# EAGLE schematic Group12_411_REV1 (EAGLE 9.2.1)
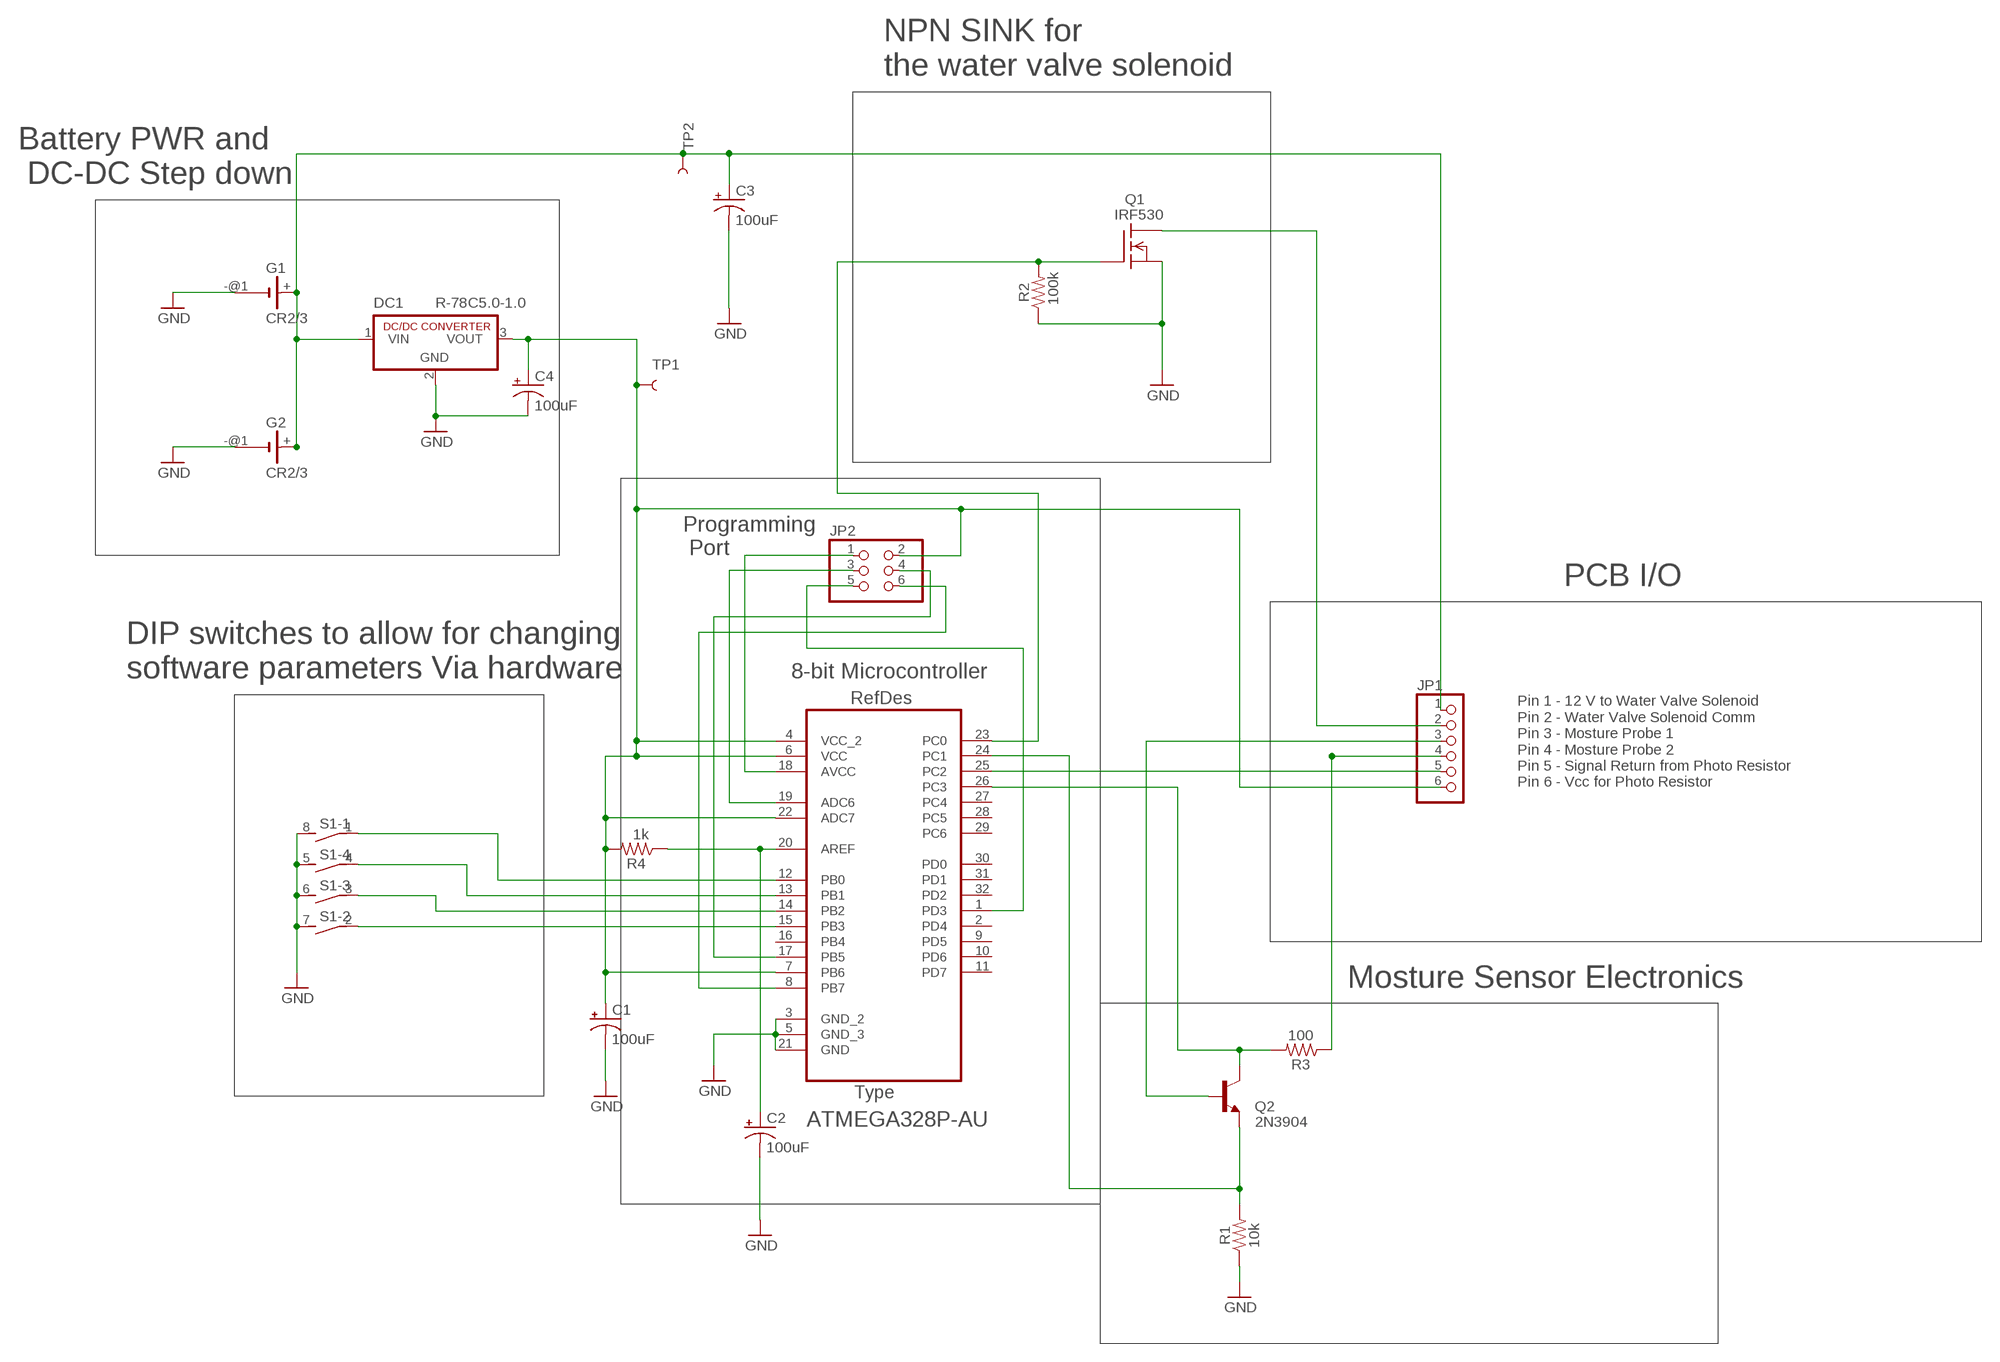
[diagram p0: schematic, sheet 1]

## Parts
ATMEGA328  ATMEGA328P-AU  [QFP80P900X900X120-32N]
C1  100uF  100UF-POLAR-EIA7343-16V-10%(TANT)  [EIA7343]
C2  100uF  100UF-POLAR-EIA7343-16V-10%(TANT)  [EIA7343]
C3  100uF  100UF-POLAR-EIA7343-16V-10%(TANT)  [EIA7343]
C4  100uF  100UF-POLAR-EIA7343-16V-10%(TANT)  [EIA7343]
DC1  R-78C5.0-1.0  [SIP3]
G1  CR2/3  [CR2/3]
G2  CR2/3  [CR2/3]
JP1  PINHD-1X6  [1X06]
JP2  PINHD-2X3  [2X03]
Q1  VN66AF  [TO202]
Q2  600mA/40V  TRANS_NPN-MMBT2222AL  [SOT23-3]
R1  R-US_M0805  [M0805]
R2  R-US_M0805  [M0805]
R3  R-US_M0805  [M0805]
R4  R-US_M0805  [M0805]
S1  DIP04S  [DIP04S]
TP1  TEST-POINT3  [PAD.03X.03]
TP2  TEST-POINT3  [PAD.03X.03]

## Nets
GND: ATMEGA328.3(GND_2) ATMEGA328.5(GND_3) ATMEGA328.21(GND) C1.C(-) C2.C(-) C3.C(-) C4.C(-) DC1.2(GND) G1.-@1(-) G2.-@1(-) Q1.1(S) R1.1 R2.1 S1.5 S1.6 S1.7 S1.8
N$1: ATMEGA328.25(PC2) JP1.5
N$2: ATMEGA328.18(AVCC) JP2.1
N$3: C3.A(+) DC1.1(VIN) G1.+ G2.+ JP1.1 TP2.P$1
N$4: ATMEGA328.17(PB5) JP2.4
N$5: ATMEGA328.19(ADC6) JP2.3
N$6: ATMEGA328.8(PB7) JP2.6
N$7: ATMEGA328.1(PD3) JP2.5
N$8: ATMEGA328.23(PC0) Q1.2(G) R2.2
N$9: JP1.3 Q2.1(B)
N$10: ATMEGA328.13(PB1) S1.4
N$11: JP1.2 Q1.3(D)
N$12: ATMEGA328.12(PB0) S1.1
N$13: ATMEGA328.14(PB2) S1.3
N$14: ATMEGA328.15(PB3) S1.2
N$15: ATMEGA328.24(PC1) Q2.2(E) R1.2
N$16: ATMEGA328.26(PC3) Q2.3(C) R3.2
N$17: ATMEGA328.20(AREF) C2.A(+) R4.1
N$18: JP1.4 R3.1
VCC: ATMEGA328.4(VCC_2) ATMEGA328.6(VCC) ATMEGA328.7(PB6) ATMEGA328.22(ADC7) C1.A(+) C4.A(+) DC1.3(VOUT) JP1.6 JP2.2 R4.2 TP1.P$1
Unconnected: ATMEGA328.2(PD4) ATMEGA328.9(PD5) ATMEGA328.10(PD6) ATMEGA328.11(PD7) ATMEGA328.16(PB4) ATMEGA328.27(PC4) ATMEGA328.28(PC5) ATMEGA328.29(PC6) ATMEGA328.30(PD0) ATMEGA328.31(PD1) ATMEGA328.32(PD2) G1.-@2(-) G2.-@2(-)

## Notes on the sheet
- NPN SINK for 
  the water valve solenoid
- Battery PWR and
   DC-DC Step down
- Programming
   Port
- PCB I/O
- DIP switches to allow for changing 
  software parameters Via hardware
- Pin 1 - 12 V to Water Valve Solenoid
  Pin 2 - Water Valve Solenoid Comm
  Pin 3 - Mosture Probe 1
  Pin 4 - Mosture Probe 2
  Pin 5 - Signal Return from Photo Resistor
  Pin 6 - Vcc for Photo Resistor
- Mosture Sensor Electronics

## Library data of the parts
ATMEGA328 = Atmel-ATMEGA328P-AU:ATMEGA328P-AU; DESCRIPTION: 8-bit Microcontroller; MPN: ATMEGA328P-AU; OC_FARNELL: 1715486; OC_NEWARK: 14R4631; PACKAGE: TQFP-32; SUPPLIER: Atmel
C1-C4 = SparkFun-Capacitors:100UF-POLAR: 100µF polarized capacitors A capacitor is a passive two-terminal electrical component used to store electrical energy temporarily in an electric field.; PROD_ID: CAP-08702
DC1 = dc-dc-converter:R-78C*-1.0: INNOLINE DC/DC-Converter 1.0 AMP SIP3 Single Output Source: Data sheet <http://www.mikrocontroller.net/attachment/150645/157764-da-01-en-DC_DC_WANDLER_R_78C5_0_1_0.pdf>
G1 G2 = battery:CR2/3: LI BATTERY Sonnenschein SL-361 PT
JP1 = pinhead:PINHD-1X6: PIN HEADER
JP2 = pinhead:PINHD-2X3: PIN HEADER
Q1 = transistor-fet:VN66AF: N-Channel Enhancement MOSFET 60V; 2A; 3,0Ohm; IRF530: 1
Q2 = SparkFun-DiscreteSemi:TRANS_NPN: NPN transistor Current controlled devices typically used to amplify current or used as a switch. BC547 - COM-08928 <http://www.sparkfun.com/products/8928> (TO-92 45V 100mA) (1.Collector 2.Base 3.Emitter) 2N3904 - COM-00521 <http://www.sparkfun.com/products/521> (TO-92 40V 200mA) (1.Emitter 2.Base 3.Collector) P2N2222A - COM-12852 <http://www.sparkfun.com/products/12852> (TO-92 40V 600mA) (1.Collector 2.Base 3.Emitter); PROD_ID: TRANS-08049; Q: 2N3904
R1 = resistor:R-US_: RESISTOR, American symbol; R: 10k
R2 = resistor:R-US_: RESISTOR, American symbol; R: 100k
R3 = resistor:R-US_: RESISTOR, American symbol; R: 100
R4 = resistor:R-US_: RESISTOR, American symbol; R: 1k
S1 = switch-dil:DIP04S: DIL/CODE SWITCH; OC_FARNELL: unknown; OC_NEWARK: unknown
TP1 TP2 = SparkFun-Connectors:TEST-POINT: SparkFun Test Points Bare copper test points for troubleshooting or In-Circuit-Testing. These are used by our Production team for verifying production board runs using pogo-pins on test beds. SparkFun Products: SparkFun LSM9DS1 Breakout <https://www.sparkfun.com/products/13284> SparkFun PSOC <https://www.sparkfun.com/products/13714> SparkFun Load Cell Amplifier <https://www.sparkfun.com/products/13879>